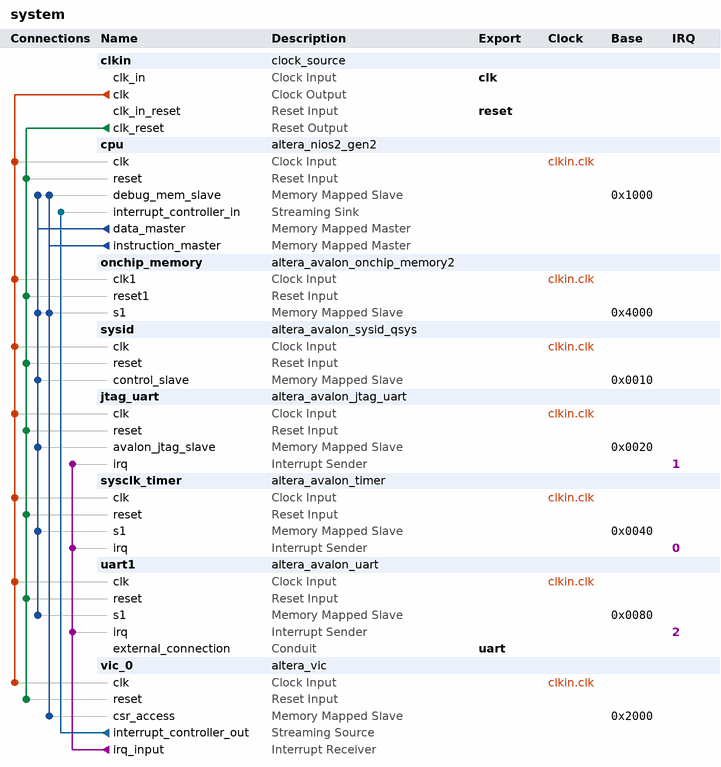
[diagram p0: system contents]
# Platform Designer (Qsys) system system, Cyclone V 5CEFA7F31I7
# Parameters at their usual value, and those the tool derives, are not listed.
package require -exact qsys 15.0
create_system system
set_project_property DEVICE_FAMILY {Cyclone V}
set_project_property DEVICE 5CEFA7F31I7

add_instance clkin clock_source 15.0
set_instance_parameter_value clkin clockFrequency 50000000

add_instance cpu altera_nios2_gen2 15.0
set_instance_parameter_value cpu dcache_size 2048
set_instance_parameter_value cpu debug_datatrigger 2
set_instance_parameter_value cpu debug_hwbreakpoint 2
set_instance_parameter_value cpu exceptionSlave onchip_memory.s1
set_instance_parameter_value cpu icache_size 4096
set_instance_parameter_value cpu impl Fast
set_instance_parameter_value cpu resetSlave onchip_memory.s1
set_instance_parameter_value cpu setting_activateTrace true
set_instance_parameter_value cpu setting_interruptControllerType External
set_instance_parameter_value cpu setting_shadowRegisterSets 7

add_instance onchip_memory altera_avalon_onchip_memory2 15.0
set_instance_parameter_value onchip_memory dataWidth 32
set_instance_parameter_value onchip_memory dualPort false
set_instance_parameter_value onchip_memory initMemContent true
set_instance_parameter_value onchip_memory initializationFileName onchip_memory
set_instance_parameter_value onchip_memory memorySize 16384

add_instance sysid altera_avalon_sysid_qsys 15.0
set_instance_parameter_value sysid id 0

add_instance jtag_uart altera_avalon_jtag_uart 15.0
set_instance_parameter_value jtag_uart simInteractiveOptions INTERACTIVE_ASCII_OUTPUT

add_instance sysclk_timer altera_avalon_timer 15.0
set_instance_parameter_value sysclk_timer period 10
set_instance_parameter_value sysclk_timer periodUnits MSEC

add_instance uart1 altera_avalon_uart 15.0
set_instance_parameter_value uart1 baud 115200
set_instance_parameter_value uart1 dataBits 8
set_instance_parameter_value uart1 fixedBaud true
set_instance_parameter_value uart1 parity NONE
set_instance_parameter_value uart1 stopBits 1

add_instance vic_0 altera_vic 15.0
set_instance_parameter_value vic_0 DAISY_CHAIN_ENABLE 0
set_instance_parameter_value vic_0 NUMBER_OF_INT_PORTS 8
set_instance_parameter_value vic_0 RIL_WIDTH 4

# connections
add_connection clkin.clk cpu.clk clock
add_connection clkin.clk jtag_uart.clk clock
add_connection clkin.clk onchip_memory.clk1 clock
add_connection clkin.clk sysclk_timer.clk clock
add_connection clkin.clk sysid.clk clock
add_connection clkin.clk uart1.clk clock
add_connection clkin.clk vic_0.clk clock
add_connection clkin.clk_reset cpu.reset reset
add_connection clkin.clk_reset jtag_uart.reset reset
add_connection clkin.clk_reset onchip_memory.reset1 reset
add_connection clkin.clk_reset sysclk_timer.reset reset
add_connection clkin.clk_reset sysid.reset reset
add_connection clkin.clk_reset uart1.reset reset
add_connection clkin.clk_reset vic_0.reset reset
add_connection cpu.data_master cpu.debug_mem_slave avalon
set_connection_parameter_value cpu.data_master/cpu.debug_mem_slave baseAddress 0x1000
add_connection cpu.data_master jtag_uart.avalon_jtag_slave avalon
set_connection_parameter_value cpu.data_master/jtag_uart.avalon_jtag_slave baseAddress 0x0020
add_connection cpu.data_master onchip_memory.s1 avalon
set_connection_parameter_value cpu.data_master/onchip_memory.s1 baseAddress 0x4000
add_connection cpu.data_master sysclk_timer.s1 avalon
set_connection_parameter_value cpu.data_master/sysclk_timer.s1 baseAddress 0x0040
add_connection cpu.data_master sysid.control_slave avalon
set_connection_parameter_value cpu.data_master/sysid.control_slave baseAddress 0x0010
add_connection cpu.data_master uart1.s1 avalon
set_connection_parameter_value cpu.data_master/uart1.s1 baseAddress 0x0080
add_connection cpu.instruction_master cpu.debug_mem_slave avalon
set_connection_parameter_value cpu.instruction_master/cpu.debug_mem_slave baseAddress 0x1000
add_connection cpu.instruction_master onchip_memory.s1 avalon
set_connection_parameter_value cpu.instruction_master/onchip_memory.s1 baseAddress 0x4000
add_connection cpu.instruction_master vic_0.csr_access avalon
set_connection_parameter_value cpu.instruction_master/vic_0.csr_access baseAddress 0x2000
add_connection vic_0.interrupt_controller_out cpu.interrupt_controller_in avalon_streaming
add_connection vic_0.irq_input jtag_uart.irq interrupt
set_connection_parameter_value vic_0.irq_input/jtag_uart.irq irqNumber 1
add_connection vic_0.irq_input sysclk_timer.irq interrupt
set_connection_parameter_value vic_0.irq_input/sysclk_timer.irq irqNumber 0
add_connection vic_0.irq_input uart1.irq interrupt
set_connection_parameter_value vic_0.irq_input/uart1.irq irqNumber 2

# exported interfaces
add_interface clk clock sink
set_interface_property clk EXPORT_OF clkin.clk_in
add_interface reset reset sink
set_interface_property reset EXPORT_OF clkin.clk_in_reset
add_interface uart conduit end
set_interface_property uart EXPORT_OF uart1.external_connection

set_interconnect_requirement {$system} qsys_mm.clockCrossingAdapter HANDSHAKE
set_interconnect_requirement {$system} qsys_mm.maxAdditionalLatency 1

save_system system.qsys
